# EasyEDA Pro project ProPrj_ESP32智能门锁_2025-03-02.epro, board PCB1
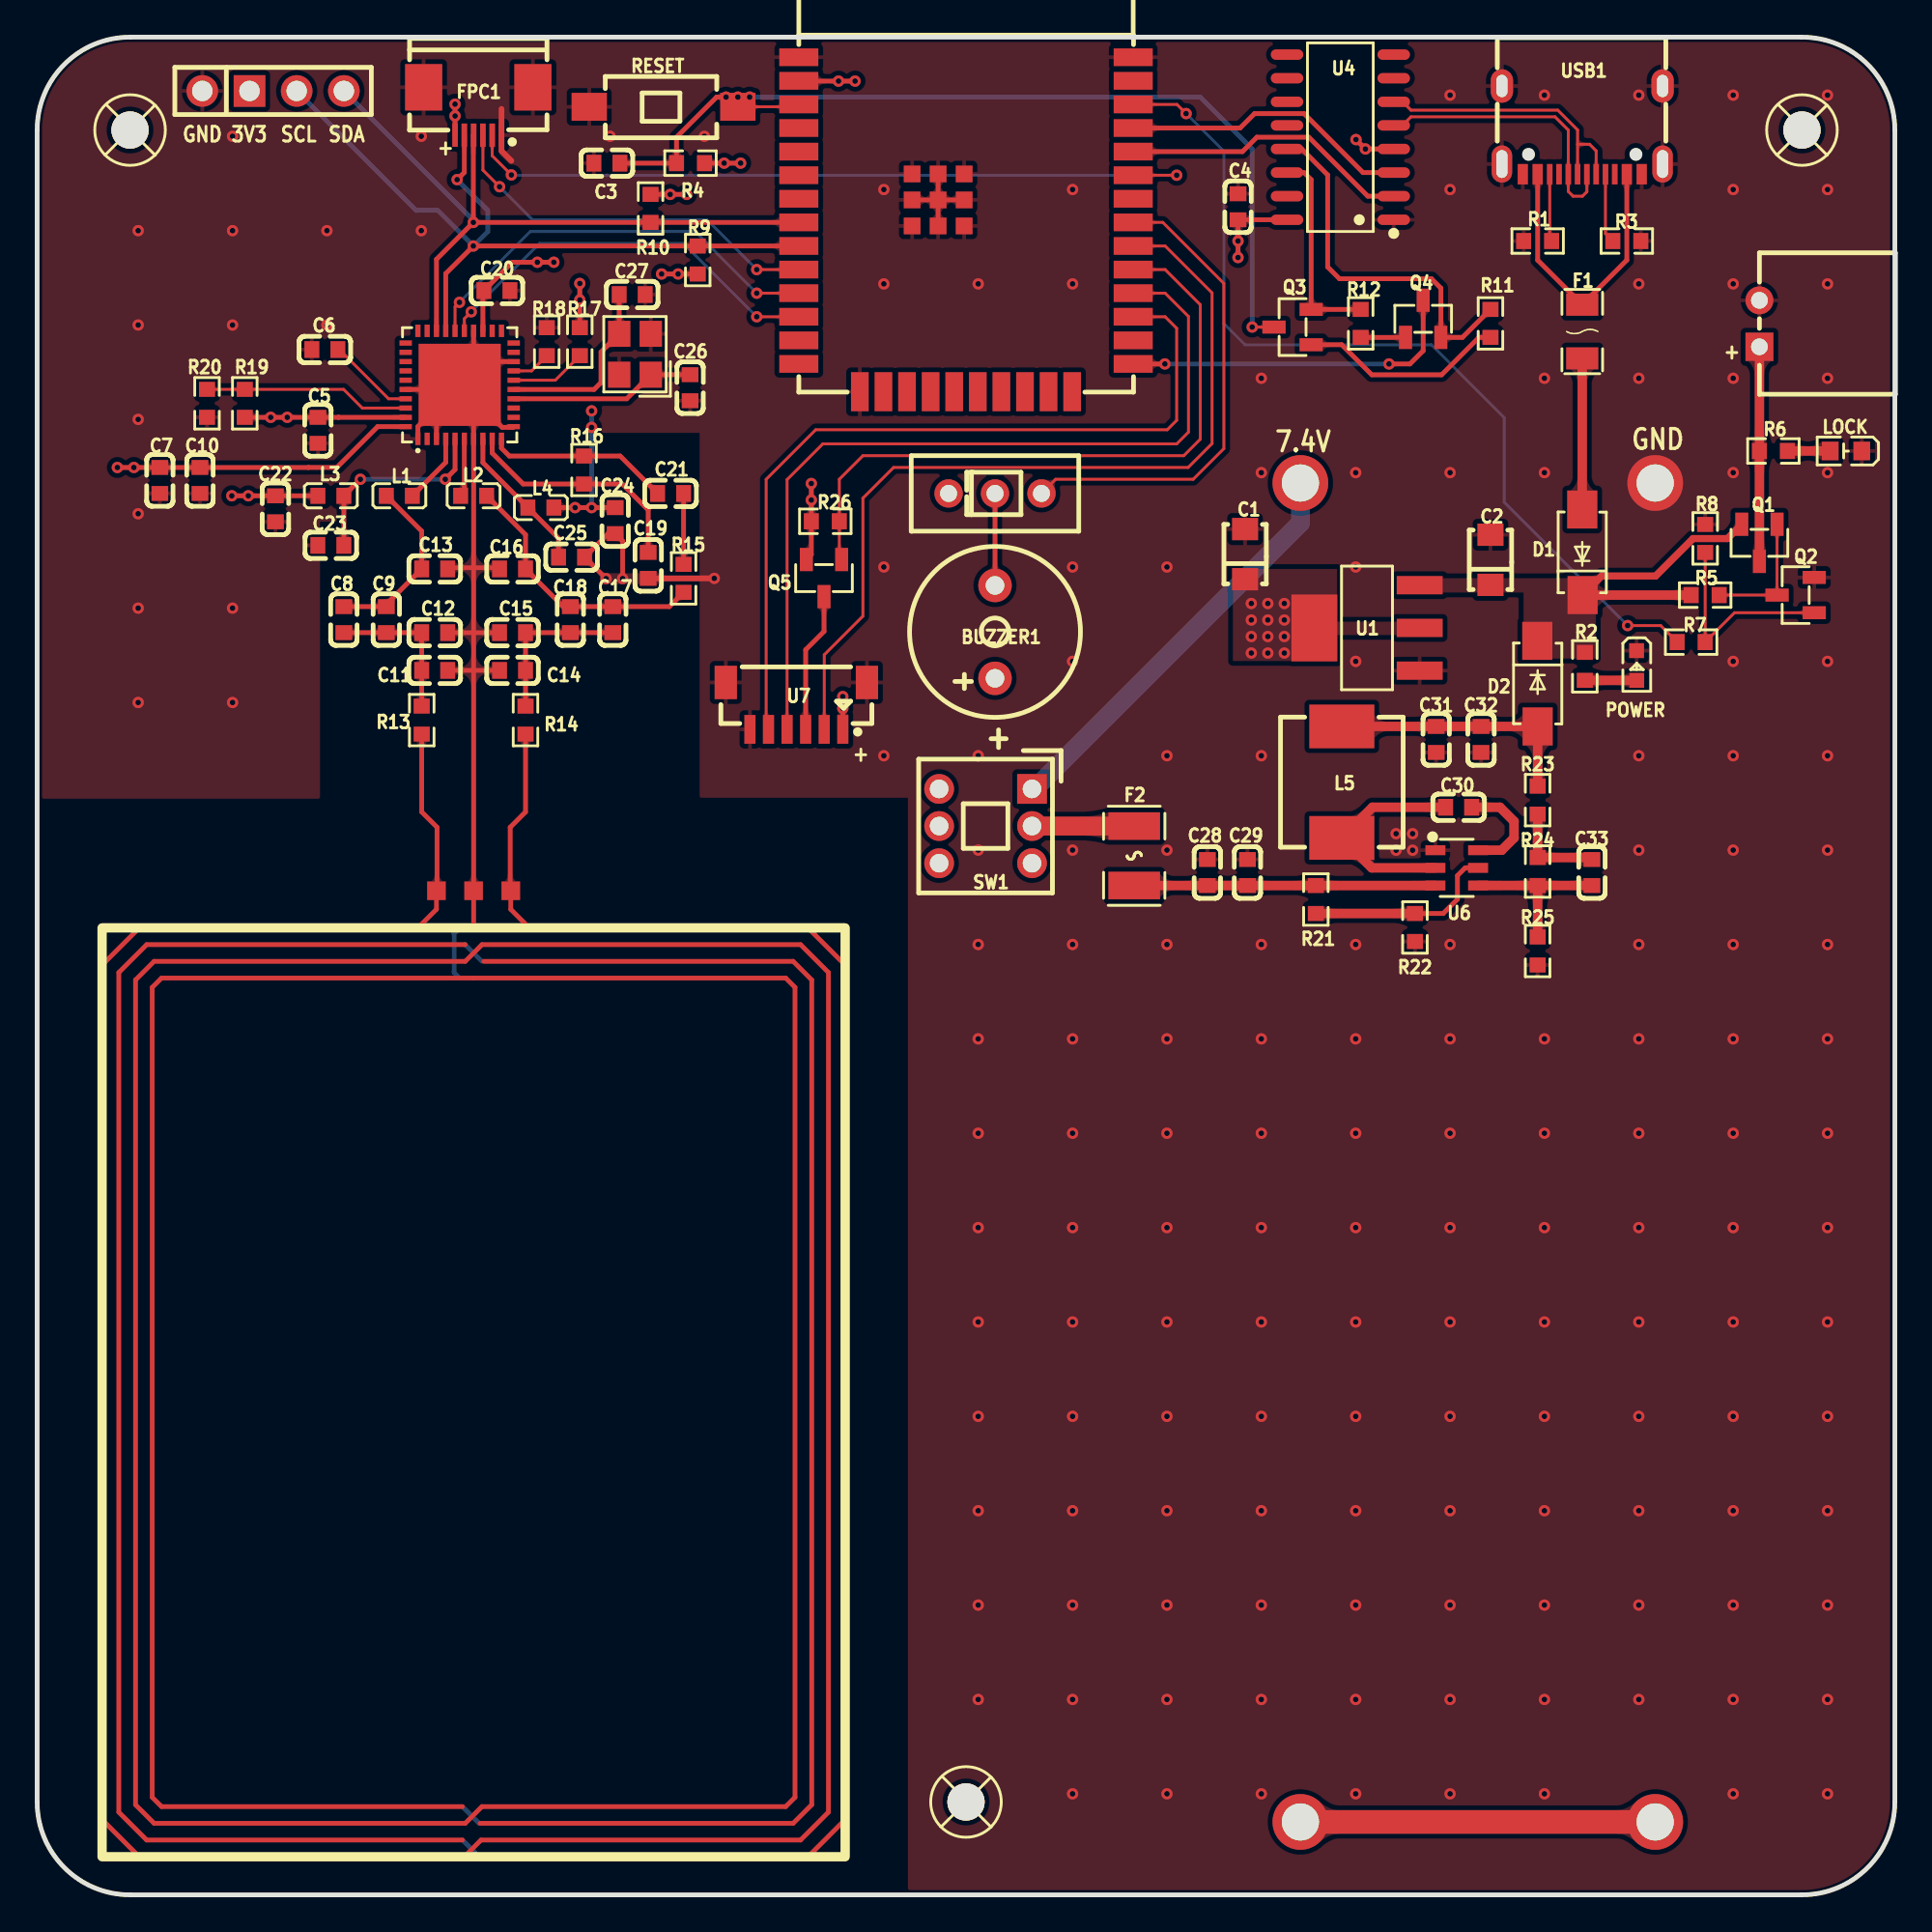
[diagram p3: board, top side]
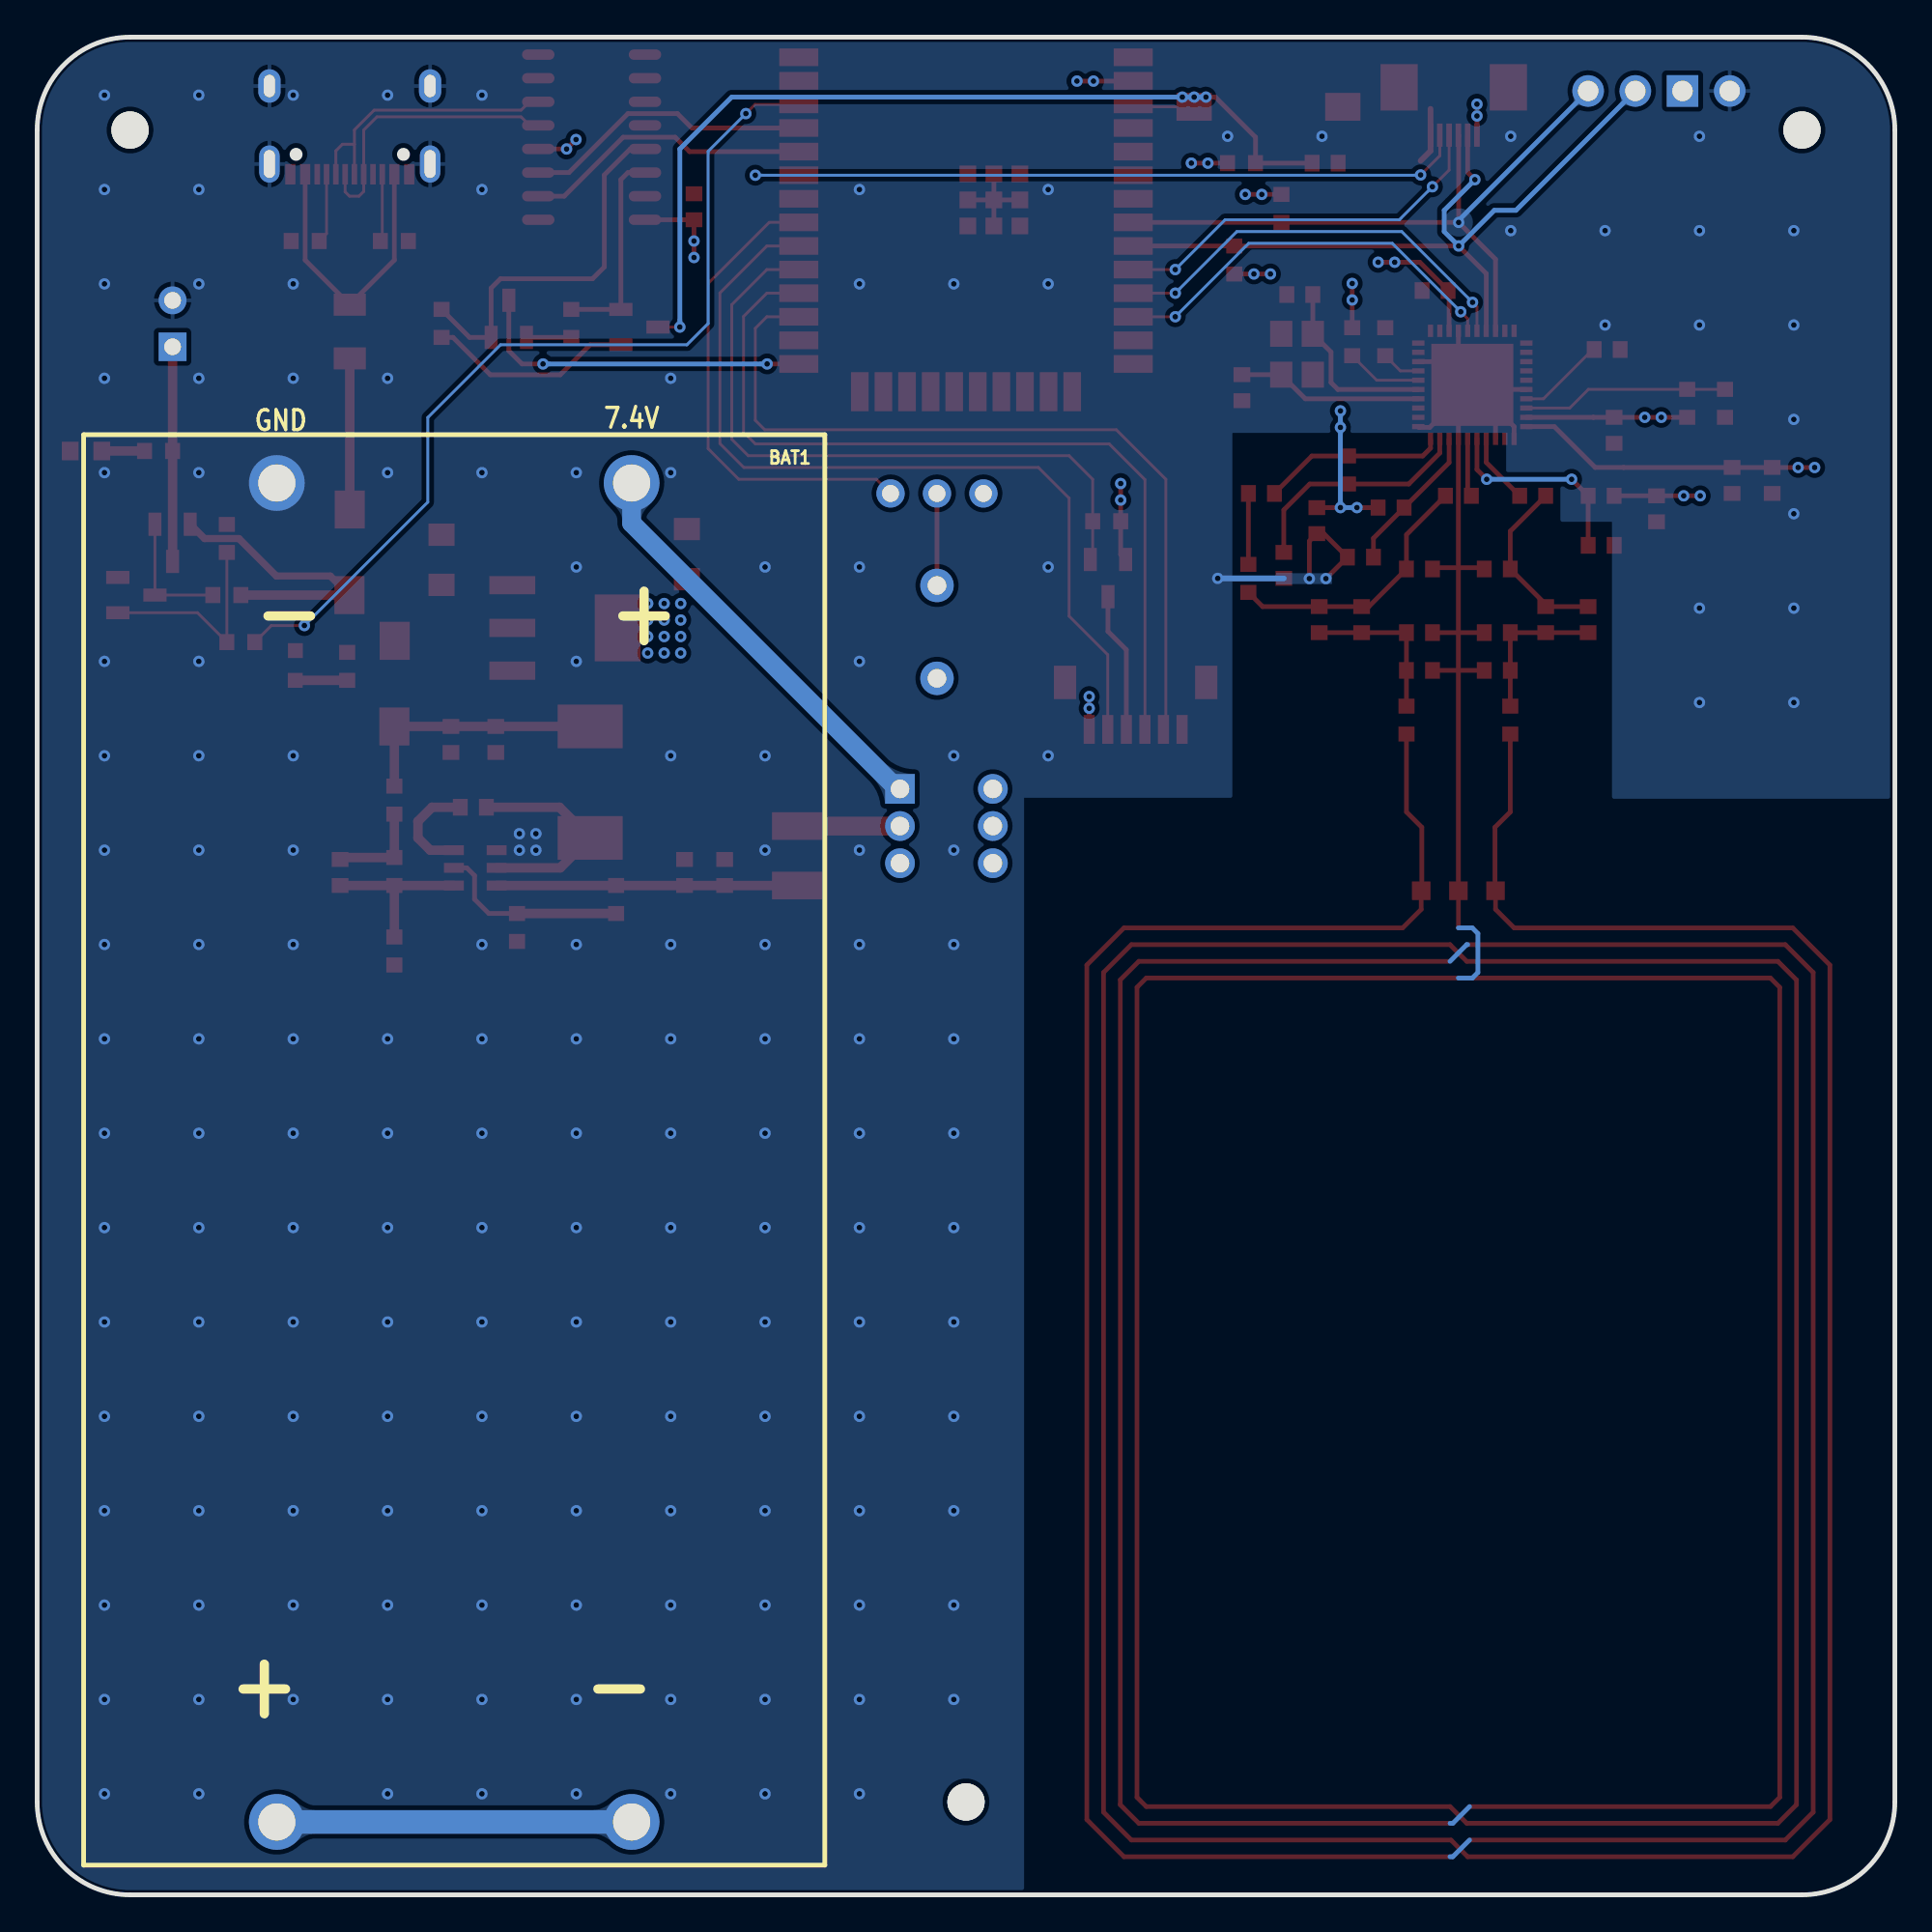
[diagram p4: board, bottom side, seen from below]

Outline 100 x 100 mm; copper layers: Top Layer, Inner1, Inner2, Bottom Layer. Coordinates in mm from the lower left corner of the outline.
Outline path: 0,95 arc(1.46,98.54) 5,100 95,100 arc(98.54,98.54) 100,95 100,5 arc(98.54,1.46) 95,0 5,0 arc(1.46,1.46) 0,5 0,95
Stack: Top Layer 0.035mm 外层铜厚1oz / Dielectric1 0.2104mm 7628 RC49% 8.6mil / Inner1 0.0152mm 内层铜厚 / Dielectric2 1.065mm 1.1mm H/HOZ Copper / Inner2 0.0152mm 内层铜厚 / Dielectric3 0.2104mm 7628 RC49% 8.6mil / Bottom Layer 0.035mm 外层铜厚1oz

## Design rules (mm)
net GND: PWR
net 3V3: PWR
net +5V: PWR
net $1N6044: PWR
net D_P: DP1
net D_N: DP1
template: JLCPCB Capability(Multiple Layers Board)
spacing copperThickness1oz (default): track to track 0.102, other pairs 0.152 to 0.3
spacing copperThickness2oz: track to track 0.203, other pairs 0.152 to 0.3
spacing copperThicknessInner0.5oz: track to track 0.089, other pairs 0.152 to 0.3
track width copperThickness1oz (default): min 0.102, default 0.254, max 2.54
track width copperThickness0.5oz: min 0.089, default 0.254, max 2.54
track width copperThickness2oz: min 0.203, default 0.254, max 2.54
differential pair differentialPair (default): width min 0.127, default 0.254, max 2.54; gap min 0.152, default 0.152
via viaSize (default): diameter min 0.3, default 0.61, max 10; hole min 0.2, default 0.305, max 6.3

## Placement (name value [footprint] x y rotation side)
A1  -  [NFC-ANT_L_50_W_40]  23.5 27.05 90 top
BAT1  BH-18650-A1BJ021  [BAT-TH_L77.0-W39.9_BH-18650-A1BJ021]  77.55 39.96 270 bottom
BUZZER1  3kHz  [BUZ-TH_BD9.0-P5.00-D0.6-FD]  51.56 67.98 90 top
C1  10uF  [CAP-SMD_L3.2-W1.6]  65.02 72.17 90 top
C2  10uF  [CAP-SMD_L3.2-W1.6]  78.23 71.87 90 top
C3  10uF  [C0603]  30.67 93.22 180 top
C4  10uF  [C0603]  64.64 90.87 270 top
C5  10uF  [C0603]  15.11 78.83 90 top
C6  10uF  [C0603]  15.49 83.19 0 top
C7  10uF  [C0603]  6.6 76.14 270 top
C8  24pF  [C0603]  16.51 68.64 270 top
C9  1pF  [C0603]  18.8 68.64 270 top
C10  100nF  [C0603]  8.76 76.14 90 top
C11  4.7pF  [C0603]  21.4 65.91 180 top
C12  120pF  [C0603]  21.4 67.94 180 top
C13  220pF  [C0603]  21.4 71.37 180 top
C14  4.7pF  [C0603]  25.59 65.91 180 top
C15  120pF  [C0603]  25.59 67.94 180 top
C16  220pF  [C0603]  25.59 71.37 180 top
C17  24pF  [C0603]  30.99 68.64 90 top
C18  1pF  [C0603]  28.7 68.64 90 top
C19  100nF  [C0603]  32.89 71.57 270 top
C20  100nF  [C0603]  24.75 86.36 180 top
C21  1nF  [C0603]  34.1 75.44 180 top
C22  22uF  [C0603]  12.83 74.61 90 top
C23  100nF  [C0603]  15.81 72.64 0 top
C24  22uF  [C0603]  31.12 73.97 90 top
C25  100nF  [C0603]  28.77 72.01 180 top
C26  20pF  [C0603]  35.15 81.13 270 top
C27  20pF  [C0603]  32.03 86.14 180 top
C28  10uF  [C0603]  62.99 55.03 270 top
C29  100nF  [C0603]  65.15 55.03 270 top
C30  100nF  [C0603]  76.52 58.55 180 top
C31  22uF  [C0603]  75.31 62.2 90 top
C32  22uF  [C0603]  77.72 62.2 90 top
C33  75pF  [C0603]  83.69 55.03 90 top
CN1  ZX-XH2.54-2PWZ  [CONN-TH_2P-P2.50_ZX-XH2.54-2PWZ]  92.71 84.58 90 top
D1  SS54  [SMA_L4.3-W2.6-LS5.0-FD]  83.18 72.27 270 top
D2  SS54  [SMA_L4.3-W2.6-LS5.0-FD]  80.76 65.2 90 top
F1  JK-nSMD050-30  [F1206]  83.17 84.15 90 top
F2  BSMD1210-150-16V  [F1210]  59.06 55.93 270 top
FPC1  FPC-05F-6PH20  [FPC-SMD_6P-P0.50_XUNPU_FPC-05F-6PH20]  23.75 96.01 180 top
H1  2.54-1*4P母  [HDR-TH_4P-P2.54-V-F]  12.7 97.1 0 top
L1  560nH  [L0603]  19.5 75.31 0 top
L2  560nH  [L0603]  23.5 75.31 180 top
L3  2.2nH  [L0603]  15.81 75.31 0 top
L4  2.2nH  [L0603]  27.12 74.68 180 top
L5  10uH  [IND-SMD_L7.3-W6.8]  70.23 59.9 90 top
LOCK  NCD0603G1  [LED0603-RD_1]  97.37 77.72 180 top
POWER  NCD0603R1  [LED0603-RD_RED]  86.1 66.18 270 top
Q1  SI2301  [SOT-23-3_L2.9-W1.3-P1.90-LS2.4-BR]  92.71 72.78 90 top
Q2  S8050  [SOT-23-3_L2.9-W1.3-P1.90-LS2.4-BR]  94.66 69.97 0 top
Q3  S8050  [SOT-23-3_L2.9-W1.3-P1.90-LS2.4-BR]  67.58 84.39 0 top
Q4  S8050  [SOT-23-3_L2.9-W1.3-P1.90-LS2.4-BR]  74.61 84.84 270 top
Q5  SI2301  [SOT-23-3_L2.9-W1.3-P1.90-LS2.4-BR]  42.36 70.88 90 top
R1  5.1kΩ  [R0603]  80.77 89.03 180 top
R2  1kΩ  [R0603]  83.31 66.13 90 top
R3  5.1kΩ  [R0603]  85.57 89.03 0 top
R4  10kΩ  [R0603]  35.17 93.22 180 top
R5  100kΩ  [R0603]  89.79 69.97 180 top
R6  1kΩ  [R0603]  93.46 77.72 180 top
R7  10kΩ  [R0603]  89.04 67.44 180 top
R8  10kΩ  [R0603]  89.79 73.02 270 top
R9  4.7kΩ  [R0603]  35.56 88 270 top
R10  4.7kΩ  [R0603]  33.02 90.78 90 top
R11  10kΩ  [R0603]  78.23 84.59 270 top
R12  10kΩ  [R0603]  71.25 84.59 270 top
R13  6.2Ω  [R0603]  20.7 63.24 90 top
R14  6.2Ω  [R0603]  26.29 63.24 90 top
R15  2kΩ  [R0603]  34.8 70.87 270 top
R16  1kΩ  [R0603]  29.44 76.7 270 top
R17  10kΩ  [R0603]  29.21 83.61 270 top
R18  10kΩ  [R0603]  27.43 83.61 270 top
R19  10kΩ  [R0603]  11.18 80.29 270 top
R20  100kΩ  [R0603]  9.14 80.29 90 top
R21  510kΩ  [R0603]  68.83 53.58 90 top
R22  100kΩ  [R0603]  74.17 52.07 90 top
R23  49.9Ω  [R0603]  80.77 58.93 90 top
R24  100kΩ  [R0603]  80.77 55.09 90 top
R25  13.3kΩ  [R0603]  80.77 50.81 90 top
R26  100kΩ  [R0603]  42.43 73.94 180 top
RESET  TS-1101-C-W  [SW-SMD_L6.0-W3.3-LS8.0]  33.72 96.25 0 top
SCREW1  -  [M2螺丝]  5 95 0 top
SCREW2  -  [M2螺丝]  95 95 0 top
SCREW3  -  [M2螺丝]  50 5 0 top
SW1  XKB7070-Z  [SW-TH_6P-L7.0-W7.0-P2.00]  51.05 57.53 0 top
U1  AMS1117-3.3  [SOT-223-4_L6.5-W3.5-P2.30-LS7.0-BR]  71.59 68.2 0 top
U2  SS-12D00-G3  [SW-TH_3P-L8.8-W3.9-P2.50_SS12D00G3]  51.56 75.44 0 top
U3  ESP32-WROOM-32E-N16  [WIFI-SMD_ESP32-WROOM-32E]  50 89.92 270 top
U4  CH340C  [SOP-16_L10.0-W3.9-P1.27-LS6.0-BL]  70.15 94.61 90 top
U5  13.56MHz  [QFN-40_L6.0-W6.0-P0.50-BL-EP]  22.75 81.28 0 top
U6  TPS54302DDCR  [SOT-23-6_L2.9-W1.6-P0.95-LS2.8-BL]  76.42 55.28 270 top
U7  BM06B-SRSS-TB(LF)(SN)  [CONN-SMD-6P-P1.00_BM06B-SRSS-TB-LF-SN]  40.87 64 180 top
USB1  TYPE-C 16PIN 2MD(073)  [USB-C-SMD_TYPE-C-6PIN-2MD-073]  83.17 95 180 top
X1  27.12MHz  [CRYSTAL-SMD_4P-L3.2-W2.5-BL]  32.18 82.93 90 top

## Footprints (pads in the part's own frame, mm; a bottom-side part is the same pattern mirrored in y, then rotated)
BAT-TH_L77.0-W39.9_BH-18650-A1BJ021
  round 3 hole 2: 1(-36.038,9.55) 2(-36.038,-9.55) 3(36.038,-9.55) 4(36.038,9.55)
BUZ-TH_BD9.0-P5.00-D0.6-FD
  round 1.8 hole 1: 1(-2.5,0) 2(2.5,0)
C0603
  rect 0.8x0.9 smd: 1(-0.7,0) 2(0.7,0)
CAP-SMD_L3.2-W1.6
  rect 1.2x1.4 smd: 1(-1.35,0) 2(1.35,0)
CONN-SMD-6P-P1.00_BM06B-SRSS-TB-LF-SN
  rect 0.6x1.55 smd: 1(-2.499,1.263) 2(-1.5,1.263) 3(-0.499,1.263) 4(0.5,1.263) 5(1.5,1.263) 6(2.5,1.262)
  rect 1.2x1.8 smd: 7(3.8,-1.263) 8(-3.8,-1.263)
CONN-TH_2P-P2.50_ZX-XH2.54-2PWZ
  rect 1.524x1.5 hole 0.9: 1(-1.25,0)
  round 1.5 hole 0.9: 2(1.25,0)
CRYSTAL-SMD_4P-L3.2-W2.5-BL
  rect 1.4x1.2 smd: 1(-1.1,-0.85) 2(1.1,-0.85) 3(1.1,0.85) 4(-1.1,0.85)
F1206
  rect 1.19x1.728 smd: 1(-1.445,0) 2(1.445,0)
F1210
  rect 1.485x2.781 smd: 1(-1.6,0) 2(1.6,0)
FPC-SMD_6P-P0.50_XUNPU_FPC-05F-6PH20
  rect 0.3x1.25 smd: 1(-1.25,1.288) 2(-0.75,1.288) 3(-0.25,1.288) 4(0.25,1.288) 5(0.75,1.288) 6(1.25,1.288)
  rect 2x2.5 smd: 7(2.94,-1.288) 8(-2.94,-1.288)
HDR-TH_4P-P2.54-V-F
  round 1.7 hole 1.1: 1(-3.81,0) 3(1.27,0) 4(3.81,0)
  rect 1.7x1.7 hole 1.1: 2(-1.27,0)
IND-SMD_L7.3-W6.8
  rect 2.35x3.5 smd: 1(-3,0) 2(3,0)
L0603
  rect 0.8x0.864 smd: 1(-0.7,0) 2(0.7,0)
LED0603-RD_1
  rect 0.9x1 smd: 1(-0.85,0) 2(0.85,0)
LED0603-RD_RED
  rect 0.8x0.8 smd: 1(-0.799,-0.004) 2(0.799,0.004)
M2螺丝
  round 2 hole 2: 1(0,0)
NFC-ANT_L_50_W_40
  rect 1x1 smd: 1(27,2) 2(27,0) 3(27,-2)
QFN-40_L6.0-W6.0-P0.50-BL-EP
  rect 0.28x0.665 smd: 1(-2.25,-2.908) 2(-1.75,-2.908) 3(-1.25,-2.908) 4(-0.75,-2.908) 5(-0.25,-2.908) 6(0.25,-2.908) 7(0.75,-2.908) 8(1.25,-2.908) 9(1.75,-2.908) 10(2.25,-2.908) 21(2.25,2.908) 22(1.75,2.908) 23(1.25,2.908) 24(0.75,2.908) 25(0.25,2.908) 26(-0.25,2.908) 27(-0.75,2.908) 28(-1.25,2.908) 29(-1.75,2.908) 30(-2.25,2.908)
  rect 0.665x0.28 smd: 11(2.908,-2.25) 12(2.908,-1.75) 13(2.908,-1.25) 14(2.908,-0.75) 15(2.908,-0.25) 16(2.908,0.25) 17(2.908,0.75) 18(2.908,1.25) 19(2.908,1.75) 20(2.908,2.25) 31(-2.908,2.25) 32(-2.908,1.75) 33(-2.908,1.25) 34(-2.908,0.75) 35(-2.908,0.25) 36(-2.908,-0.25) 37(-2.908,-0.75) 38(-2.908,-1.25) 39(-2.908,-1.75) 40(-2.908,-2.25)
  rect 4.42x4.42 smd: 41(0,0)
R0603
  rect 0.806x0.864 smd: 1(-0.753,0) 2(0.753,0)
SMA_L4.3-W2.6-LS5.0-FD
  rect 2.046x1.62 smd: 1(-2.304,-0.009) 2(2.304,0.009)
SOP-16_L10.0-W3.9-P1.27-LS6.0-BL
  oval 0.56x1.745 smd: 1(-4.445,-2.873) 2(-3.175,-2.873) 3(-1.905,-2.873) 4(-0.635,-2.873) 5(0.635,-2.873) 6(1.905,-2.873) 7(3.175,-2.873) 8(4.445,-2.873) 9(4.445,2.873) 10(3.175,2.873) 11(1.905,2.873) 12(0.635,2.873) 13(-0.635,2.873) 14(-1.905,2.873) 15(-3.175,2.873) 16(-4.445,2.873)
SOT-23-3_L2.9-W1.3-P1.90-LS2.4-BR
  rect 1.25x0.7 smd: 1(1,-0.95) 2(1,0.95) 3(-1,0)
SOT-23-6_L2.9-W1.6-P0.95-LS2.8-BL
  rect 0.532x1.072 smd: 1(-0.95,-1.149) 2(0,-1.149) 3(0.95,-1.149) 4(0.95,1.149) 5(0,1.149) 6(-0.95,1.149)
SOT-223-4_L6.5-W3.5-P2.30-LS7.0-BR
  rect 2.47x0.98 smd: 1(2.835,-2.3) 2(2.835,0) 3(2.835,2.3)
  rect 2.47x3.6 smd: 4(-2.835,0)
SW-SMD_L6.0-W3.3-LS8.0
  rect 1.9x1.5 smd: 1(-4,0) 2(4,0)
SW-TH_3P-L8.8-W3.9-P2.50_SS12D00G3
  round 1.524 hole 0.914: 1(-2.5,0) 2(0,0) 3(2.5,0)
SW-TH_6P-L7.0-W7.0-P2.00
  rect 1.6x1.6 hole 1: 1(2.499,2)
  round 1.6 hole 1: 2(2.5,0) 3(2.5,-2) 4(-2.5,2) 5(-2.5,0) 6(-2.5,-2)
USB-C-SMD_TYPE-C-6PIN-2MD-073
  rect 0.55x1.1 smd: 1(-3.2,2.375) 2(-2.4,2.375) 11(2.4,2.375) 12(3.2,2.375)
  rect 0.3x1.1 smd: 3(-1.75,2.375) 4(-1.25,2.375) 5(-0.75,2.375) 6(-0.25,2.375) 7(0.25,2.375) 8(0.75,2.375) 9(1.25,2.375) 10(1.75,2.375)
  oval 1.1x2 hole 0.6x1.5: 13(-4.325,1.825) 14(4.325,1.825)
  oval 1.2x1.8 hole 0.6x1.2: 13(-4.325,-2.375) 14(4.325,-2.375)
WIFI-SMD_ESP32-WROOM-32E
  rect 0.95x2.1 smd: 1(-9.002,-9) 2(-7.732,-9) 3(-6.463,-9) 4(-5.192,-9) 5(-3.922,-9) 6(-2.652,-9) 7(-1.383,-9) 8(-0.113,-9) 9(1.157,-9) 10(2.428,-9) 11(3.697,-9) 12(4.968,-9) 13(6.237,-9) 14(7.508,-9) 25(7.508,9) 26(6.237,9) 27(4.968,9) 28(3.697,9) 29(2.428,9) 30(1.157,9) 31(-0.113,9) 32(-1.383,9) 33(-2.652,9) 34(-3.922,9) 35(-5.192,9) 36(-6.463,9) 37(-7.732,9) 38(-9.002,9)
  rect 2.1x0.95 smd: 15(9.002,-5.715) 16(9.002,-4.445) 17(9.002,-3.175) 18(9.002,-1.905) 19(9.002,-0.635) 20(9.002,0.635) 21(9.002,1.905) 22(9.002,3.175) 23(9.002,4.445) 24(9.002,5.715)
  rect 0.9x0.9 smd: 39(-2.721,-0.1) 39(-2.721,-1.5) 39(-2.721,-2.9) 39(-1.321,-0.1) 39(-1.321,-1.5) 39(-1.321,-2.9) 39(0.079,-0.1) 39(0.079,-1.5) 39(0.079,-2.9)

## Nets
As in the schematic, except:
$1N5616: Q1.1 Q2.3 R5.1

Pads without a net: SCREW1 1; SCREW2 1; SCREW3 1; SW1 3 4 5 6; U2 1; U3 4 5 6 13 14 16 17 18 19 20 21 22 23 24 26 32 37; U4 7 8 9 10 11 12 15; U5 2 12 13 19 20 21 22 29 30 31 32 33 34 35; USB1 3 9

## Via types
v1: diameter 0.61, hole 0.305, Top Layer to Bottom Layer, 234 vias

## Routing (per net, layer and track width the routed paths; a pad name or vN(x,y) marks a point on that pad's centre or on a via; arc(x,y) is an arc through that point)
3V3: length 64.7
  Top Layer w0.254: 22.5,95.89 v1(22.5,96.39) ; v1(37.87,93.22) v1(36.98,93.22) R4.1 ; U5.40 18.33,79.03 16.13,76.84 14.61,76.84 14.6,76.83 v1(5.21,76.83) v1(4.32,76.83) ; C24.2 v1(29.84,74.68) v1(28.96,74.68) L4.1 ; L3.1 v1(11.37,75.31) v1(10.48,75.31) ; 43.37,62.74 43.37,64.5 v1(43.37,64.5) ; v1(33.61,87.25) v1(34.5,87.25) 35.56,87.25 ; v1(64.64,88.14) v1(64.64,89.03) C4.2 U4.16 ; 15.24,79.53 16.23,79.53 16.23,79.54 16.23,79.53 U5.39 ; FPC1.6 v1(22.5,95.76) ; R17.1 v1(29.21,85.85) v1(29.21,86.74) ; U4.4 v1(71.5,93.98) v1(70.99,94.49) ; R19.2 v1(12.57,79.53) v1(13.46,79.53) C5.2 ; R10.2 v1(34.08,91.53) v1(34.97,91.53) ; Q5.2 41.67,72.15 v1(41.67,75.08) v1(41.67,75.97) ; v1(44.03,97.63) v1(43.14,97.63) 41.01,97.63 U3.2
  Bottom Layer w0.254: v1(28.96,74.68) v1(29.84,74.68) v1(29.84,78.99) v1(29.84,79.88)
  vias: v1(43.37,63.87) v1(65.36,69.51) v1(65.36,68.62) v1(65.36,67.74) v1(65.36,66.85) v1(66.25,69.51) v1(66.25,68.62) v1(66.25,67.74) v1(66.25,66.85) v1(67.14,69.51) v1(67.14,68.62) v1(67.14,67.74) v1(67.14,66.85)
+5V: length 16
  Top Layer w0.381: Q1.2 90.99,73.01 89.14,73.01 87.12,70.99 84.22,70.99 83.19,69.97
  Top Layer w0.508: 83.19,69.97 R5.2
AVDD: length 8.1
  Top Layer w0.254: U5.8 24,77.1 L4.2 28.07,73.03 C25.2
GND: length 72.8
  Top Layer w0.254: 29.47,72.01 C25.1 ; 29.47,72.01 30.74,73.28 31.12,73.28 31.52,72.88 v1(31.52,70.85) ; 29.47,72.01 v1(30.63,70.85) ; 23.25,81.78 U5.41 ; U5.41 22.5,81.03 ; U5.41 23.25,80.78 ; U5.1 20.5,79.03 21.5,80.03 U5.3 ; 23.53,71.44 24.91,71.44 ; 23.5,65.91 23.5,54.05 ; 23.5,65.91 C11.1 ; 23.5,65.91 23.5,67.94 ; 23.5,65.91 C14.2 ; U3.39 U3.39 ; U3.39 U3.39 ; U3.39 U3.39 ; U3.39 U3.39 ; 22.5,81.03 22.25,80.78 ; 22.5,81.03 U5.36 ; 23.5,67.94 C12.1 ; 23.5,67.94 C15.2 ; 23.5,67.94 23.5,71.44 ; U5.18 24,82.53 23.5,82.03 U5.24 ; U5.11 25.61,78.99 25.03,78.99 23.5,80.53 U5.7 23.5,71.44 22.13,71.44
  Top Layer w0.305: v1(36.45,70.87) C19.2 ; 25.53,93.34 25,93.88 FPC1.1 25,96.14
  Bottom Layer w0.305: v1(36.45,70.87) C19.2
  vias: v1(5.44,89.58) v1(5.44,84.5) v1(5.44,79.42) v1(5.44,74.34) v1(5.44,69.26) v1(5.44,64.18) v1(10.52,94.66) v1(10.52,89.58) v1(10.52,84.5) v1(10.52,69.26) v1(10.52,64.18) v1(15.6,89.58) v1(15.6,84.5) v1(20.68,94.66) v1(20.68,89.58) v1(30.84,94.66) v1(35.92,94.66) v1(45.58,91.8) v1(45.58,86.72) v1(45.58,71.48) v1(45.58,61.32) v1(50.66,86.72) v1(50.66,61.32) v1(50.66,56.24) v1(50.66,51.16) v1(50.66,46.08) v1(50.66,41) v1(50.66,35.92) v1(50.66,30.84) v1(50.66,25.76) v1(50.66,20.68) v1(50.66,15.6) v1(50.66,10.52) v1(55.74,91.8) v1(55.74,86.72) v1(55.74,71.48) v1(55.74,66.4) v1(55.74,56.24) v1(55.74,51.16) v1(55.74,46.08) v1(55.74,41) v1(55.74,35.92) v1(55.74,30.84) v1(55.74,25.76) v1(55.74,20.68) v1(55.74,15.6) v1(55.74,10.52) v1(55.74,5.44) v1(60.82,71.48) v1(60.82,61.32) v1(60.82,56.24) v1(60.82,51.16) v1(60.82,46.08) v1(60.82,41) v1(60.82,35.92) v1(60.82,30.84) v1(60.82,25.76) v1(60.82,20.68) v1(60.82,15.6) v1(60.82,10.52) v1(60.82,5.44) v1(65.9,81.64) v1(65.9,76.56) v1(65.9,61.32) v1(65.9,51.16) v1(65.9,46.08) v1(65.9,41) v1(65.9,35.92) v1(65.9,30.84) v1(65.9,25.76) v1(65.9,20.68) v1(65.9,15.6) v1(65.9,10.52) v1(65.9,5.44) v1(70.98,76.56) v1(70.98,71.48) v1(70.98,66.4) v1(70.98,51.16) v1(70.98,46.08) v1(70.98,41) v1(70.98,35.92) v1(70.98,30.84) v1(70.98,25.76) v1(70.98,20.68) v1(70.98,15.6) v1(70.98,10.52) v1(70.98,5.44) v1(73.15,57.12) v1(73.15,56.23) v1(74.04,57.12) v1(74.04,56.23) v1(76.06,96.88) v1(76.06,91.8) v1(76.06,76.56) v1(76.06,51.16) v1(76.06,46.08) v1(76.06,41) v1(76.06,35.92) v1(76.06,30.84) v1(76.06,25.76) v1(76.06,20.68) v1(76.06,15.6) v1(76.06,10.52) v1(76.06,5.44) v1(81.14,96.88) v1(81.14,81.64) v1(81.14,76.56) v1(81.14,46.08) v1(81.14,41) v1(81.14,35.92) v1(81.14,30.84) v1(81.14,25.76) v1(81.14,20.68) v1(81.14,15.6) v1(81.14,10.52) v1(81.14,5.44) v1(86.22,96.88) v1(86.22,86.72) v1(86.22,81.64) v1(86.22,61.32) v1(86.22,56.24) v1(86.22,51.16) v1(86.22,46.08) v1(86.22,41) v1(86.22,35.92) v1(86.22,30.84) v1(86.22,25.76) v1(86.22,20.68) v1(86.22,15.6) v1(86.22,10.52) v1(91.3,96.88) v1(91.3,91.8) v1(91.3,86.72) v1(91.3,81.64) v1(91.3,76.56) v1(91.3,66.4) v1(91.3,61.32) v1(91.3,56.24) v1(91.3,51.16) v1(91.3,46.08) v1(91.3,41) v1(91.3,35.92) v1(91.3,30.84) v1(91.3,25.76) v1(91.3,20.68) v1(91.3,15.6) v1(91.3,10.52) v1(91.3,5.44) v1(96.38,96.88) v1(96.38,91.8) v1(96.38,86.72) v1(96.38,81.64) v1(96.38,76.56) v1(96.38,66.4) v1(96.38,61.32) v1(96.38,56.24) v1(96.38,51.16) v1(96.38,46.08) v1(96.38,41) v1(96.38,35.92) v1(96.38,30.84) v1(96.38,25.76) v1(96.38,20.68) v1(96.38,15.6) v1(96.38,10.52) v1(96.38,5.44)
PVDD: length 6.6
  Top Layer w0.254: v1(27.81,87.88) v1(26.92,87.88) 25.57,87.88 C20.2 24,86.31 U5.23
VBUS: length 16
  Top Layer w0.254: USB1.11 80.77,88 F1.2 85.57,88 USB1.2
BUZZER: length 26
  Top Layer w0.152: U3.31 60.59,90.03 63.88,86.74 63.88,77.85 62.23,76.2 54.82,76.2 U2.3
CH340_RXD: length 15.7
  Top Layer w0.254: U3.35 64.76,95.11 65.53,95.89 68.2,95.89 71.37,92.71 U4.3
CH340_TXD: length 15.7
  Top Layer w0.254: U4.2 71.63,91.44 68.45,94.61 65.66,94.61 64.88,93.84 U3.34
D_N: length 15.3
  Top Layer w0.155: U4.6 73.5,96.52 73.95,96.07 81.86,96.07 82.92,95 82.92,94.23 ; 82.92,94.23 83.57,94.23 83.92,93.88 USB1.5 ; 82.92,94.23 USB1.7
D_P: length 15.3
  Top Layer w0.155: U4.5 73.49,95.25 73.95,95.71 81.71,95.71 82.42,95 USB1.8 82.42,91.69 82.68,91.44 83.19,91.44 83.42,91.68 USB1.6
DTR: length 20.2
  Top Layer w0.254: U4.13 68.07,93.98 69.47,92.58 69.47,87.63 70.1,87 75.06,87 75.56,86.49 75.56,83.84 ; Q4.2 76.73,83.84 R11.1
EN: length 52.8
  Top Layer w0.152: v1(65.41,84.39) Q3.3 ; RESET.2 40.87,96.25 U3.3
  Top Layer w0.254: C3.1 R4.2 34.42,94.61 36.58,96.77 v1(38.35,96.77)
  Bottom Layer w0.254: v1(37.08,96.77) v1(37.72,96.77) v1(38.35,96.77) 62.61,96.77 65.41,93.98 v1(65.41,84.39)
FT6336U_INT: length 21.1
  Top Layer w0.152: FPC1.3 24,92.84 v1(24.89,91.95) ; U3.10 v1(38.74,87.49)
  Bottom Layer w0.152: v1(24.89,91.95) 26.67,90.17 36.05,90.17 v1(38.74,87.49)
FT6336U_RST: length 40.7
  Top Layer w0.152: FPC1.2 24.5,93.61 v1(25.53,92.58) ; U3.33 v1(61.34,92.57)
  Bottom Layer w0.152: v1(61.34,92.57) 25.54,92.57 v1(25.53,92.58)
I0: length 4.1
  Top Layer w0.152: R17.2 27.89,81.53 U5.16
I1: length 2.1
  Top Layer w0.152: U5.17 26.61,82.03 R18.2
I2C_SCL: length 42.8
  Top Layer w0.254: FPC1.5 23,92.72 v1(22.61,92.33) ; U3.9 v1(23.48,88.76) 22,87.27 U5.27
  Bottom Layer w0.254: H1.3 20.4,90.68 21.56,90.68 v1(23.48,88.76) 24.26,89.53 24.26,90.68 v1(22.61,92.33)
I2C_SDA: length 38.8
  Top Layer w0.254: U3.8 R10.1 23.62,90.03 23.55,90.1 ; FPC1.4 23.48,94.71 v1(23.48,90.03) 21.5,88.04 U5.28
  Bottom Layer w0.254: H1.4 23.48,90.13 v1(23.48,90.03)
IO0: length 18.6
  Top Layer w0.254: Q4.3 74.61,83.12 73.9,82.41 v1(72.77,82.41) ; U3.25 v1(60.71,82.41)
  Bottom Layer w0.254: v1(72.77,82.41) v1(60.71,82.41)
LOCK_5V: length 11.6
  Top Layer w0.508: Q1.3 R6.2 CN1.1
LOCK_CTL: length 49.4
  Top Layer w0.152: v1(85.62,68.33) 87.39,68.33 88.28,67.44 ; U3.36 61.36,96.38 v1(61.85,95.89)
  Bottom Layer w0.152: v1(85.62,68.33) 78.97,74.97 78.97,79.52 75.06,83.44 65.02,83.44 63.88,84.58 63.88,93.85 v1(61.85,95.89)
OSCIN: length 10
  Top Layer w0.254: C26.1 X1.1 31.74,80.53 U5.14
OSCOUT: length 10
  Top Layer w0.254: C27.2 31.33,84.03 30.35,83.05 30.35,81.41 29.98,81.03 U5.15
PN532_INT: length 22
  Top Layer w0.152: v1(23.37,85.22) 23,84.84 U5.25 ; U3.12 v1(38.74,84.95)
  Bottom Layer w0.152: v1(38.74,84.95) 34.78,88.9 27.05,88.9 v1(23.37,85.22)
PN532_RST: length 22.9
  Top Layer w0.152: v1(22.73,85.72) 22.5,85.49 U5.26 ; U3.11 v1(38.74,86.22)
  Bottom Layer w0.152: v1(22.73,85.72) 26.54,89.53 35.42,89.53 v1(38.74,86.22)
RSTPD_N: length 11.1
  Top Layer w0.152: U5.38 17.5,80.03 16.49,81.04 R19.1 R20.2
RTS: length 11.2
  Top Layer w0.254: R12.1 Q3.2 68.58,92.33 68.2,92.71 67.23,92.71
RX: length 9.9
  Top Layer w0.254: U5.10 25,77.88 25.42,77.45 R16.1 31.38,77.45 C21.2
TVDD: length 10.9
  Top Layer w0.254: v1(17.4,76.2) L3.2 16.51,72.64 ; v1(21.97,76.2) 22.5,76.72 U5.5
  Bottom Layer w0.254: v1(17.4,76.2) v1(21.97,76.2)
TX1: length 3.8
  Top Layer w0.254: U5.4 22,77.11 L1.2
TX2: length 3.1
  Top Layer w0.254: U5.6 23,75.51 L2.2
VMID: length 12.7
  Top Layer w0.254: U5.9 24.5,77.61 26.16,75.95 R16.2 31.5,75.95 32.89,74.55 C19.1
ZW101_CTL: length 36.3
  Top Layer w0.152: U3.29 60.72,87.49 62.61,85.6 62.61,78.36 61.72,77.47 44.45,77.47 43.18,76.2 R26.1 43.18,72.01 Q5.1
ZW101_INT: length 46.7
  Top Layer w0.152: U3.30 60.72,88.76 63.25,86.23 63.25,78.12 61.96,76.83 46.1,76.83 44.45,75.18 44.45,68.83 42.37,66.75 42.37,62.74
ZW101_RX: length 44.5
  Top Layer w0.152: U3.27 60.72,84.95 61.34,84.33 61.34,79.38 60.83,78.87 41.91,78.87 39.24,76.2 39.24,62.87 39.37,62.74
ZW101_TX: length 45.8
  Top Layer w0.152: U3.28 60.72,86.22 61.98,84.96 61.98,78.74 61.34,78.11 42.29,78.11 40.37,76.18 U7.4
ZW101_VCC: length 7.6
  Top Layer w0.254: 41.37,62.74 41.37,67.02 42.36,68.01 Q5.3
$1N2642: length 11.2
  Top Layer w0.254: Q3.1 70.23,83.44 71.85,81.82 75.6,81.82 77.62,83.84 R11.2
$1N2757: length 2.4
  Top Layer w0.254: 71.25,83.84 Q4.1
$1N5616: length 6.9
  Top Layer w0.152: Q1.1 Q2.3 R5.1
$1N5857: length 2.3
  Top Layer w0.508: R6.1 LOCK.2
$1N6044: length 8.8
  Top Layer w0.508: 83.17,73.95 F1.1
$1N8498: length 2.8
  Top Layer w0.508: R2.1 86.11,65.38
$1N17322: length 3.6
  Top Layer w0.152: R1.1 81.42,89.13 USB1.10
$1N17376: length 3.8
  Top Layer w0.152: USB1.4 84.42,89.42 R3.1
$1N17503: length 5
  Top Layer w0.254: BUZZER1.2 U2.2
$1N17870: length 11.4
  Top Layer w0.152: Q2.1 91.37,69.02 89.79,67.44 89.79,72.26
$2N11916: length 9.8
  Top Layer w0.254: L1.1 20.7,73.41 C13.2 18.8,69.47 C9.1 C8.1
$2N11917: length 14.5
  Top Layer w0.254: L2.1 26.29,73.22 C16.1 28.32,69.34 C18.2 C17.2 34.03,69.34 R15.2
$2N11919: length 3.8
  Top Layer w0.254: C21.1 R15.1
$2N11925: length 8.8
  Top Layer w0.254: 21.53,54.05 21.53,57.47 20.7,58.29 R13.1
$2N11926: length 8.1
  Top Layer w0.254: 20.7,63.99 C11.2 C12.2 C9.2 C8.2
$2N11927: length 8.8
  Top Layer w0.254: R14.1 26.29,58.29 25.46,57.47 25.46,54.05
$2N11928: length 8.7
  Top Layer w0.254: 26.29,63.99 C14.1 C15.1 C18.1 C17.1
$2N29530: length 4.7
  Top Layer w0.152: U5.37 18.92,80.53 16.23,83.22
$3N3212: length 16.1
  Top Layer w0.508: 59.18,54.33 C28.2 75.27,54.33
$3N3216: length 22.5
  Bottom Layer w1.016: SW1.1 53.69,59.53 68,73.84 BAT1.1
$3N3418: length 5.5
  Top Layer w1.016: F2.1 53.55,57.53
$3N11108: length 10.5
  Top Layer w0.254: R22.2 75.69,52.83 76.45,53.59 76.45,54.86 76.87,55.28 U6.5
  Top Layer w0.508: R21.1 74.17,52.83
$3N11159: length 12
  Top Layer w0.508: C30.2 71.88,58.55 L5.1 71.84,55.28 U6.2
$3N11163: length 5.7
  Top Layer w0.508: U6.6 78.84,56.23 79.5,56.9 79.5,57.78 78.74,58.55 C30.1
$3N11747: length 5.3
  Top Layer w0.508: C33.2 83.59,55.84 R24.2 R23.1
$3N11772: length 8.6
  Top Layer w0.508: R25.2 R24.1 U6.4 ; C33.1 81.03,54.33
$3N15028: length 38.2
  Top Layer w1.27: BAT1.4 BAT1.3
  Bottom Layer w1.27: BAT1.4 BAT1.3
$3N15058: length 13.8
  Top Layer w0.508: L5.2 C31.2 C32.2 D2.1 R23.2

## Copper pours and planes (outline as drawn; the poured copper is in the pictures)
3V3 on Top Layer: 64.37,71.37 75.44,71.37 75.44,66.42 64.37,66.42
3V3 on Inner2: 0.26,99.74 99.74,99.74 99.74,0.26 0.26,0.26
+5V on Top Layer: 73.28,70.88 83.9,70.88 83.9,66.55 73.28,66.55
GND on Top Layer: 85.22,77.88 88.98,77.88 88.98,74.12 85.22,74.12
GND on Top Layer: -1.78,100.97 102.62,100.97 102.62,-2.54 -1.78,-2.54
GND on Top Layer: 30.3,71.15 33.3,71.15 33.3,70.56 30.3,70.56
GND on Bottom Layer: 84.82,78.28 89.38,78.28 89.38,73.72 84.82,73.72
GND on Bottom Layer: 30.3,71.15 33.3,71.15 33.3,70.56 30.3,70.56
GND on Bottom Layer: -1.91,101.25 102.62,101.25 102.62,-2.54 -1.91,-2.54
GND on Inner1: 0.26,99.74 99.74,99.74 99.74,0.26 0.26,0.26

Small or netless copper shapes (teardrops, artwork), in the pictures only: 355 on Top Layer, 37 on Bottom Layer, 28 on Inner1, 8 on Inner2

## Text on the board
Bottom Silkscreen Layer: 7.4V | GND | - | +
Top Silkscreen Layer: + | GND | 3V3 | SCL | SDA | 7.4V
